# EAGLE design Grove Cape for BeagleBone Series v1.0 (EAGLE 7.1.0)
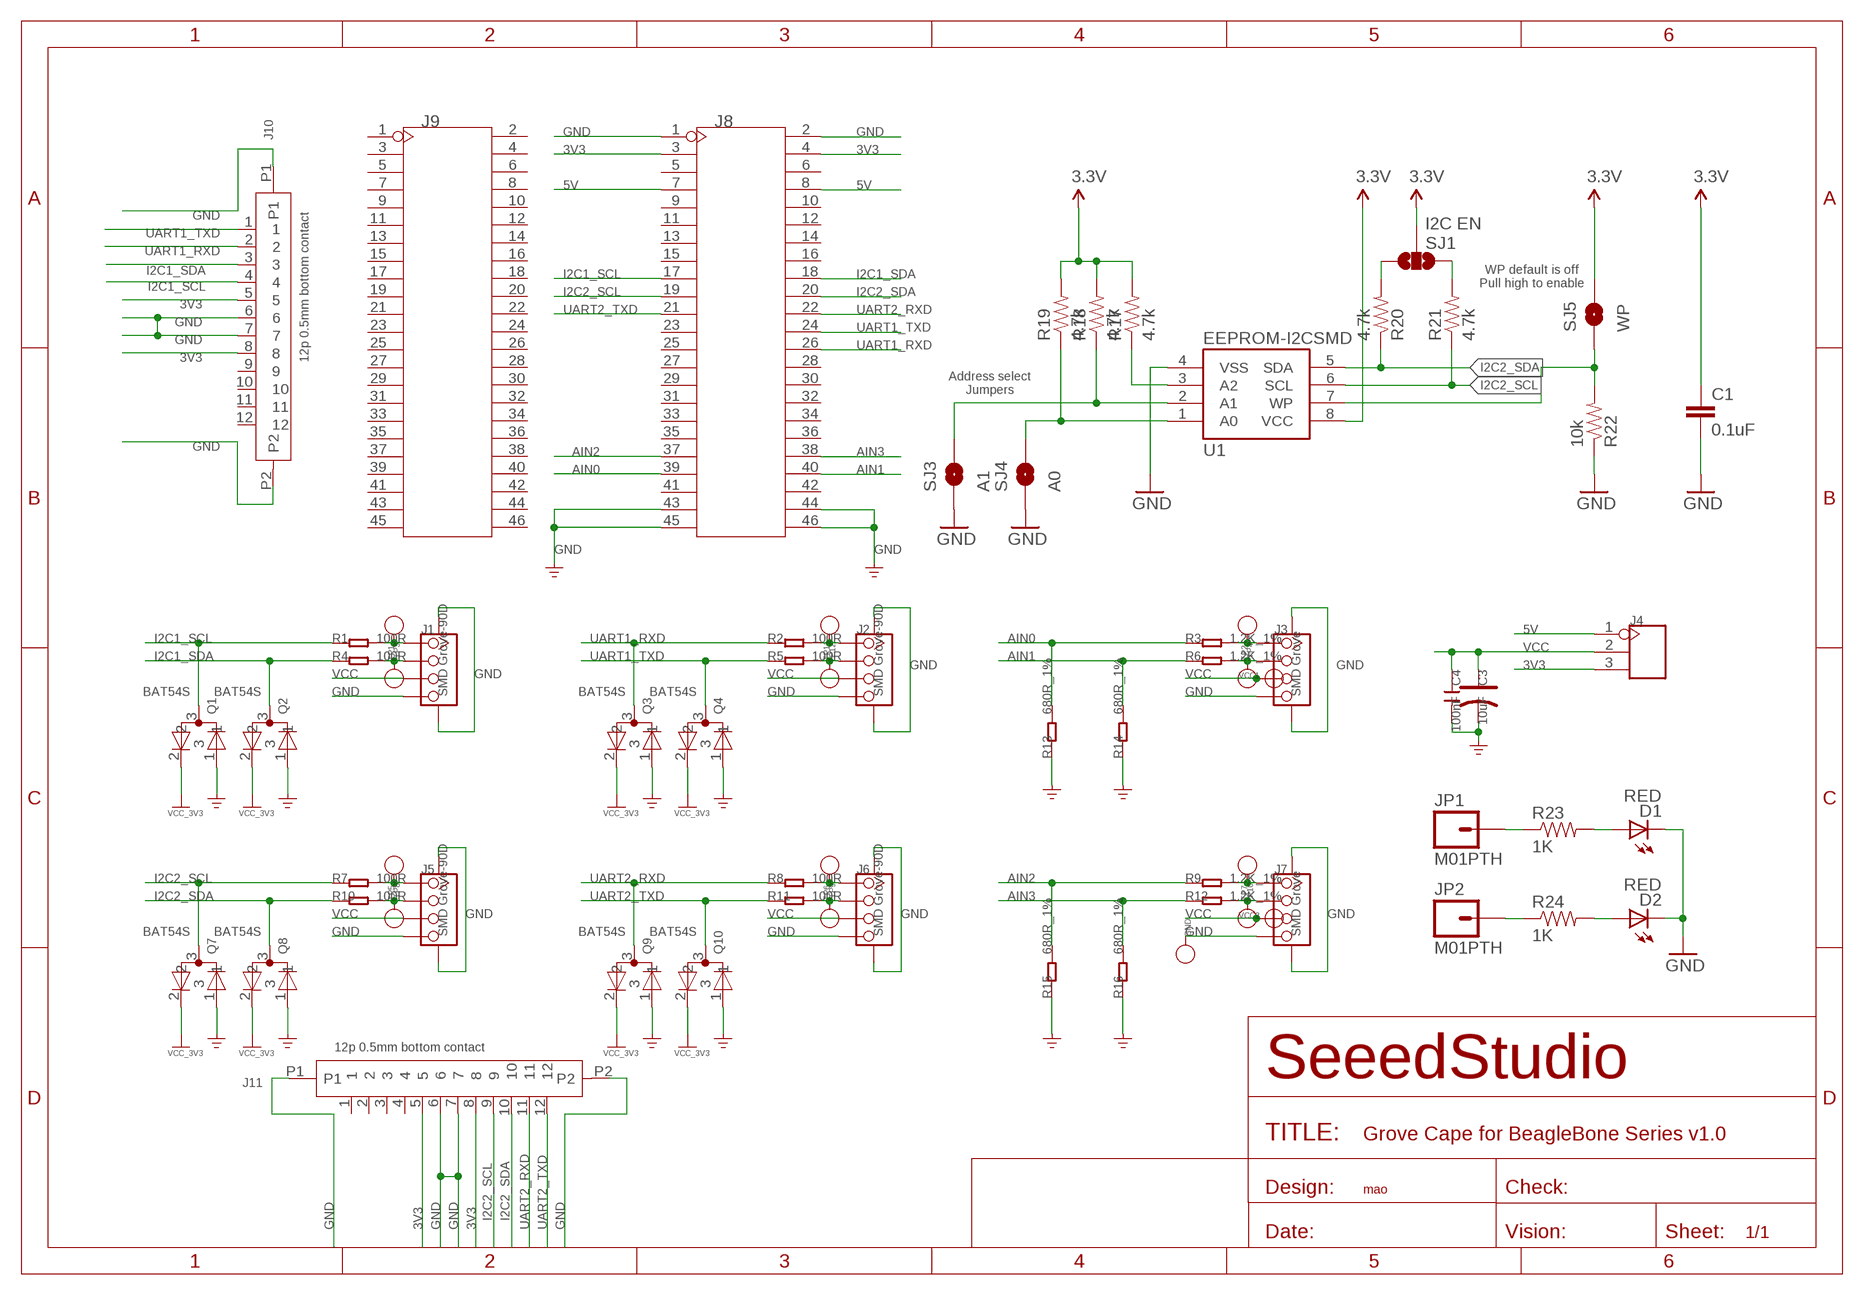
[diagram p0: schematic, sheet 1]

## Parts
C1  0.1uF  0.1UF-25V(+80/-20%)(0603)  [0603-CAP]
C3  10uF  CAP-AVX-A  [AVX-A]
C4  100nF  C-0603  [C0603]
D1  RED  LED-RED0603  [LED-0603]
D2  RED  LED-RED0603  [LED-0603]
GND  PAD-TEST-POINT'4545'  [TP_4545]
J1  SMD Grove-90D  TWIG-4P-2.0-SMD-FEMALE-REINFORCE'DD'  [4P-SMD-2.0]
J2  SMD Grove-90D  TWIG-4P-2.0-SMD-FEMALE-REINFORCE'DD'  [4P-SMD-2.0]
J3  SMD Grove  TWIG-4P-2.0-SMD-FEMALE-REINFORCE'DD'  [4P-SMD-2.0]
J4  HEADER-3P-2.54  [3P-2.54]
J5  SMD Grove-90D  TWIG-4P-2.0-SMD-FEMALE-REINFORCE'DD'  [4P-SMD-2.0]
J6  SMD Grove-90D  TWIG-4P-2.0-SMD-FEMALE-REINFORCE'DD'  [4P-SMD-2.0]
J7  SMD Grove  TWIG-4P-2.0-SMD-FEMALE-REINFORCE'DD'  [4P-SMD-2.0]
J8  HEADER-2X23P  [2X23P-2.54]
J9  HEADER-2X23P  [2X23P-2.54]
J10  12p 0.5mm bottom contact  FPC052002-12LT  [12P-0.5]
J11  12p 0.5mm bottom contact  FPC052002-12LT  [12P-0.5]
JP1  M01PTH  [1X01]
JP2  M01PTH  [1X01]
Q1  BAT54S  BAV99  [SOT23]
Q2  BAT54S  BAV99  [SOT23]
Q3  BAT54S  BAV99  [SOT23]
Q4  BAT54S  BAV99  [SOT23]
Q7  BAT54S  BAV99  [SOT23]
Q8  BAT54S  BAV99  [SOT23]
Q9  BAT54S  BAV99  [SOT23]
Q10  BAT54S  BAV99  [SOT23]
R1  100R  R-0603  [R0603]
R2  100R  R-0603  [R0603]
R3  1.2K_1%  R-0603  [R0603]
R4  100R  R-0603  [R0603]
R5  100R  R-0603  [R0603]
R6  1.2K_1%  R-0603  [R0603]
R7  100R  R-0603  [R0603]
R8  100R  R-0603  [R0603]
R9  1.2K_1%  R-0603  [R0603]
R10  100R  R-0603  [R0603]
R11  100R  R-0603  [R0603]
R12  1.2K_1%  R-0603  [R0603]
R13  680R_1%  R-0603  [R0603]
R14  680R_1%  R-0603  [R0603]
R15  680R_1%  R-0603  [R0603]
R16  680R_1%  R-0603  [R0603]
R17  4.7k  4.7KOHM1/10W1%(0603)  [0603]
R18  4.7k  4.7KOHM1/10W1%(0603)  [0603]
R19  4.7k  4.7KOHM1/10W1%(0603)  [0603]
R20  4.7k  4.7KOHM1/10W1%(0603)  [0603]
R21  4.7k  4.7KOHM1/10W1%(0603)  [0603]
R22  10k  10KOHM1/10W1%(0603)0603  [0603-RES]
R23  1K  1KOHM1/10W1%(0603)  [0603-RES]
R24  1K  1KOHM1/10W1%(0603)  [0603-RES]
SJ1  I2C EN  SOLDERJUMPER_2WAYPASTE1&2&3  [SJ_3_PASTE1&2&3]
SJ3  A1  SOLDERJUMPERNO  [SJ_2S-NO]
SJ4  A0  SOLDERJUMPERNO  [SJ_2S-NO]
SJ5  WP  SOLDERJUMPERNO  [SJ_2S-NO]
TP1  PAD-TEST-POINT'4545'  [TP_4545]
TP2  PAD-TEST-POINT'4545'  [TP_4545]
TP3  PAD-TEST-POINT'4545'  [TP_4545]
TP4  PAD-TEST-POINT'4545'  [TP_4545]
TP5  PAD-TEST-POINT'4545'  [TP_4545]
TP6  PAD-TEST-POINT'4545'  [TP_4545]
TP7  PAD-TEST-POINT'4545'  [TP_4545]
TP8  PAD-TEST-POINT'4545'  [TP_4545]
TP9  PAD-TEST-POINT'4545'  [TP_4545]
TP10  PAD-TEST-POINT'4545'  [TP_4545]
TP11  PAD-TEST-POINT'4545'  [TP_4545]
TP12  PAD-TEST-POINT'4545'  [TP_4545]
U1  EEPROM-I2CSMD  [SO08]
VCC1  PAD-TEST-POINT'4545'  [TP_4545]
VCC2  PAD-TEST-POINT'4545'  [TP_4545]

## Nets
3V3: C1.1 J4.3 J8.3 J8.4 J10.5 J10.8 J11.5 J11.8 Q1.2 Q2.2 Q3.2 Q4.2 Q7.2 Q8.2 Q9.2 Q10.2 R17.2 R18.2 R19.2 SJ1.2 SJ5.2 U1.8(VCC) ; supply symbol labelled 3.3V, VCC_3V3
5V: J4.1 J8.7 J8.8
A0: R19.1 SJ4.2 U1.1(A0)
A1: R18.1 SJ3.2 U1.2(A1)
AIN0: J8.39 R3.1 R13.2
AIN1: J8.40 R6.1 R14.2
AIN2: J8.37 R9.1 R15.2
AIN3: J8.38 R12.1 R16.2
GND: C1.2 C3.- C4.2 D1.C D2.C GND.T J1.4 J1.SS1 J1.SS2 J2.4 J2.SS1 J2.SS2 J3.4 J3.SS1 J3.SS2 J5.4 J5.SS1 J5.SS2 J6.4 J6.SS1 J6.SS2 J7.4 J7.SS1 J7.SS2 J8.1 J8.2 J8.43 J8.44 J8.45 J8.46 J10.6 J10.7 J10.P1 J10.P2 J11.6 J11.7 J11.P1 J11.P2 Q1.1 Q2.1 Q3.1 Q4.1 Q7.1 Q8.1 Q9.1 Q10.1 R13.1 R14.1 R15.1 R16.1 R22.1 SJ3.1 SJ4.1 U1.4(VSS)
I2C1_SCL: J8.17 J10.4 Q1.3 R1.1
I2C1_SDA: J8.18 J10.3 Q2.3 R4.1
I2C2_SCL: J8.19 J11.9 Q7.3 R7.1 R21.1 U1.6(SCL)
I2C2_SDA: J8.20 J11.10 Q8.3 R10.1 R20.1 U1.5(SDA)
N$1: R17.1 U1.3(A2)
N$2: J7.1 R9.2 TP7.T
N$3: J7.2 R12.2 TP10.T
N$4: J1.1 R1.2 TP1.T
N$5: J1.2 R4.2 TP3.T
N$6: J2.1 R2.2 TP11.T
N$7: J2.2 R5.2 TP12.T
N$8: J5.1 R7.2 TP5.T
N$9: J5.2 R10.2 TP8.T
N$10: J6.1 R8.2 TP6.T
N$11: J6.2 R11.2 TP9.T
N$12: J3.1 R3.2 TP2.T
N$13: J3.2 R6.2 TP4.T
N$16: R20.2 SJ1.3
N$17: R21.2 SJ1.1
N$18: R22.2 SJ5.1 U1.7(WP)
N$19: D1.A R23.2
N$20: D2.A R24.2
N$21: JP1.1 R23.1
N$30: JP2.1 R24.1
UART1_RXD: J8.26 J10.2 Q3.3 R2.1
UART1_TXD: J8.24 J10.1 Q4.3 R5.1
UART2_RXD: J8.22 J11.11 Q9.3 R8.1
UART2_TXD: J8.21 J11.12 Q10.3 R11.1
VCC: C3.+ C4.1 J1.3 J2.3 J3.3 J4.2 J5.3 J6.3 J7.3 VCC1.T VCC2.T
Unconnected: J8.5 J8.6 J8.9 J8.10 J8.11 J8.12 J8.13 J8.14 J8.15 J8.16 J8.23 J8.25 J8.27 J8.28 J8.29 J8.30 J8.31 J8.32 J8.33 J8.34 J8.35 J8.36 J8.41 J8.42 J9.1 J9.2 J9.3 J9.4 J9.5 J9.6 J9.7 J9.8 J9.9 J9.10 J9.11 J9.12 J9.13 J9.14 J9.15 J9.16 J9.17 J9.18 J9.19 J9.20 J9.21 J9.22 J9.23 J9.24 J9.25 J9.26 J9.27 J9.28 J9.29 J9.30 J9.31 J9.32 J9.33 J9.34 J9.35 J9.36 J9.37 J9.38 J9.39 J9.40 J9.41 J9.42 J9.43 J9.44 J9.45 J9.46 J10.9 J10.10 J10.11 J10.12 J11.1 J11.2 J11.3 J11.4

## Notes on the sheet
- WP default is off
  Pull high to enable
- Address select
  Jumpers
- mao

## Library data of the parts
C1 = SparkFun-Capacitors:0.1UF-25V(+80/-20%)(0603): CAP-00810 Ceramic Standard decoupling cap; PROD_ID: CAP-00810
C3 = Discrete:CAP*: Electrolytic Capacitors,Tantalum Capacitors and Super Capacitors
C4 = Discrete:C*: Ceramic Capacitors
D1 D2 = SparkFun-LED:LED-RED: Assorted Red LEDs LilyPad 1206- DIO-09912 1206- DIO-00809 0603- DIO-00819; PROD_ID: DIO-00819
GND TP1-TP12 VCC1 VCC2 = Discrete:PAD-TEST-POINT; PARTNO: DNP
J1-J3 J5-J7 = Connector :TWIG-4P-2.0-SMD-FEMALE-REINFORCE
J4 = Connector :HEADER-3P
J8 J9 = Connector :HEADER-2X23P
J10 J11 = template:FPC052002-12LT
JP1 JP2 = SparkFun-Connectors:M01: Header 1 Standard 1-pin 0.1" header. Use with straight break away headers (SKU : PRT-00116), right angle break away headers (PRT-00553), swiss pins (PRT-00743), machine pins (PRT-00117), and female headers (PRT-00115).
Q1-Q4 Q7-Q10 = template:BAV99
R1-R16 = Discrete:R*
R17-R21 = SparkFun-Resistors:4.7KOHM1/10W1%(0603): RES-07857; PROD_ID: RES-07857
R22 = SparkFun-Resistors:10KOHM1/10W1%(0603): RES-00824; PROD_ID: RES-00824; VALUE: 10K
R23 R24 = SparkFun-Resistors:1KOHM1/10W1%(0603): RES-07856; PROD_ID: RES-07856
SJ1 = SparkFun-Passives:SOLDERJUMPER_2WAY: Solder Jumper 2 way solder jumper
SJ3-SJ5 = SparkFun-Passives:SOLDERJUMPER: Solder Jumper Standard SMD solder jumper. Used to automate production. Two varients : Normally Open and Normally Closed are the same, but have different paste layers. NC will have a large amount of paste and should jumper during reflow.
U1 = SparkFun-DigitalIC:EEPROM-I2C: I2C EEPROM chips, 24LC256 (and others)

## Net classes
0 default: width 0.152 mm, drill 0.305 mm, clearance 0.152 mm

## Board
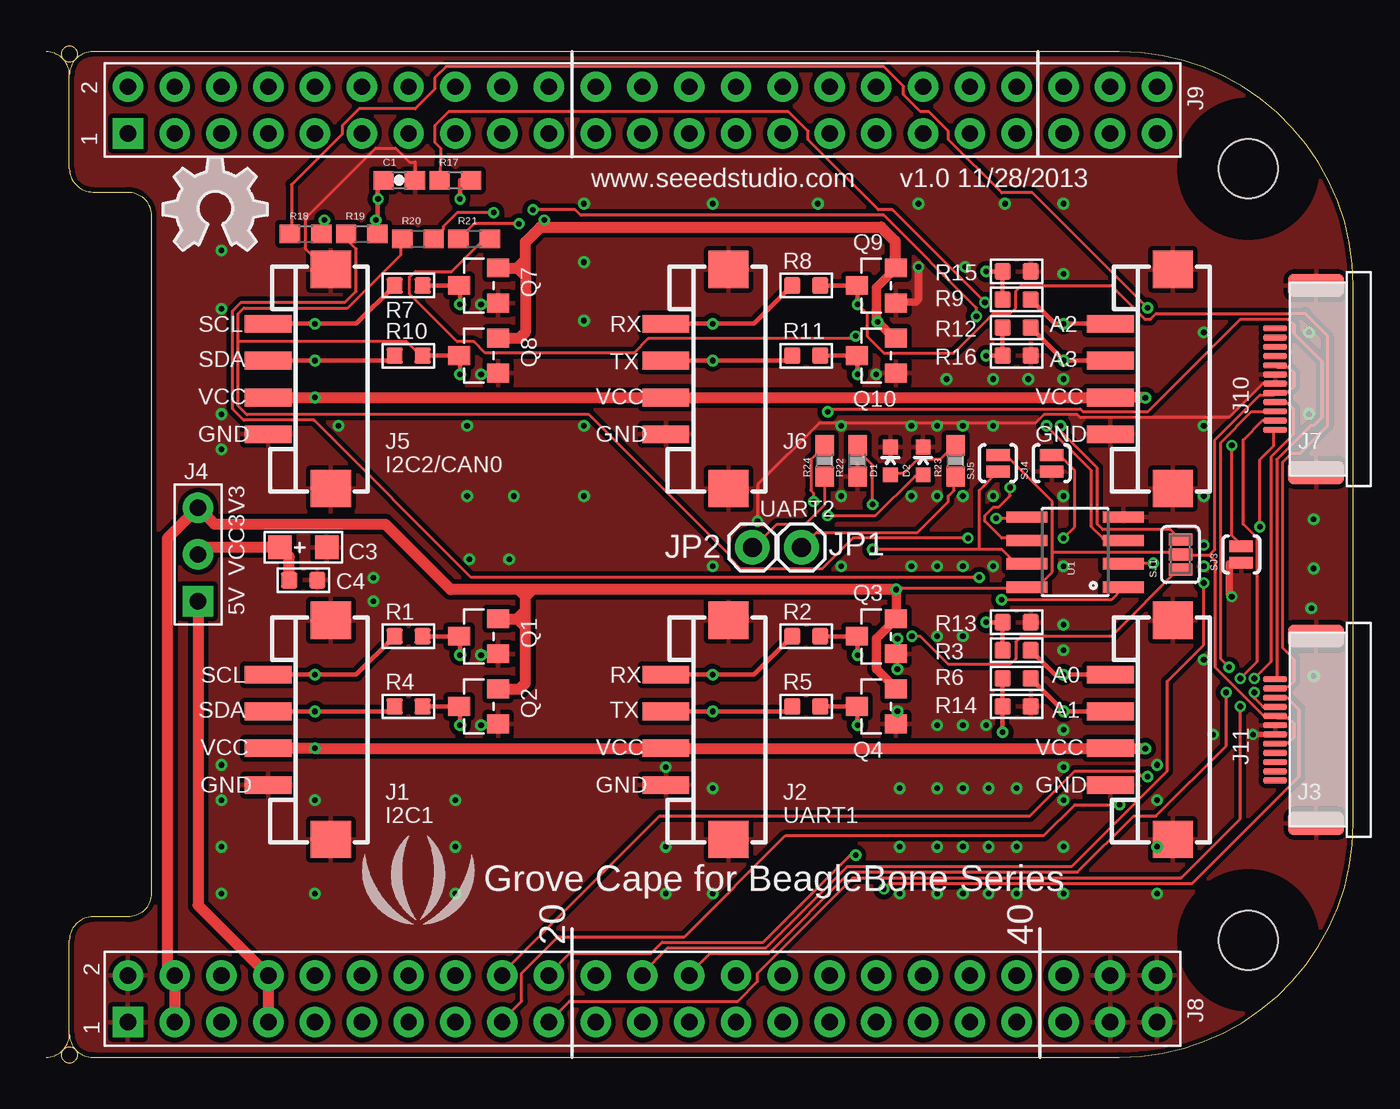
[diagram p1: board, top side]
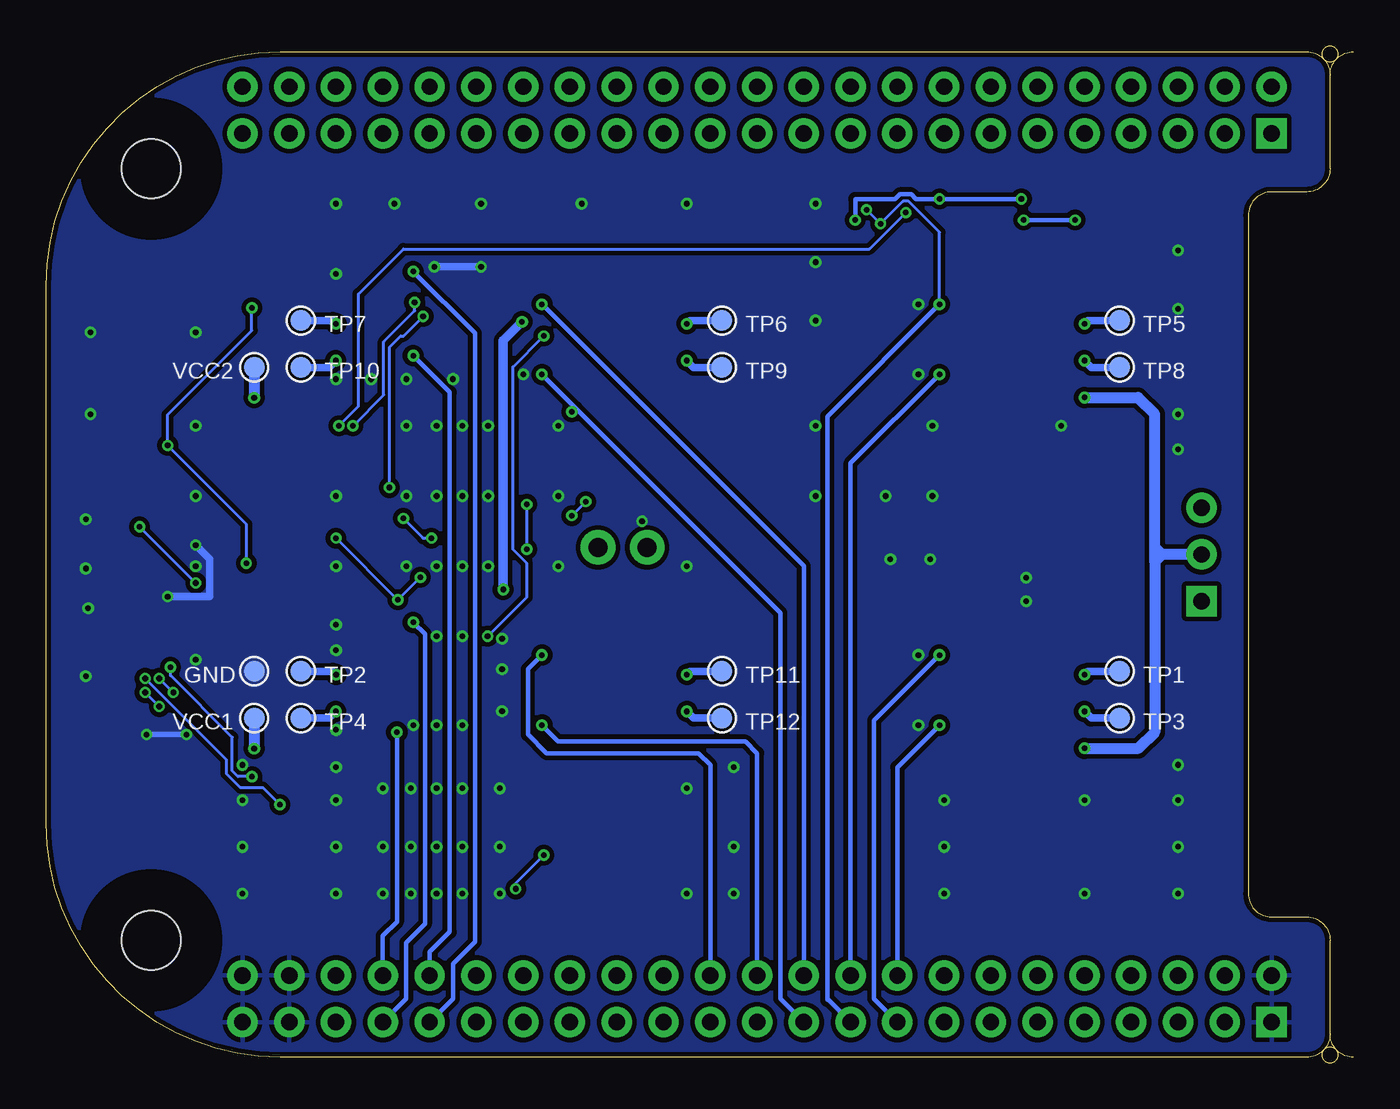
[diagram p2: board, bottom side, seen from below]

Size 70.99 x 55.22 mm. Coordinates in mm from the lower left corner, seen from the top.
Outline: 1.27,1.57 arc90 2.54,0.3 58.29,0.3 arc90 70.99,13 70.99,42.21 arc90 58.29,54.91 2.54,54.91 arc90 1.27,53.64
Outline: 1.27,53.64 1.27,48.56 arc90 2.54,47.29 4.45,47.29 arc-90 5.71,46.02 5.71,9.19 arc-90 4.45,7.92 2.54,7.92 arc90 1.27,6.65 1.27,1.57
Outline: 1.27,53.64 arc90 0,54.91
Outline: 0,0.3 arc90 1.27,1.57
Outline: circle at 1.27,0.43 radius 0.43
Outline: circle at 1.27,54.79 radius 0.43
Copper layers (1*16): Top 0.035mm / dielectric 1.5mm / Bottom 0.035mm
Design rules "SeeedStudio_2layer_DRU_no_angle_20140221": minimum track width 6mil, minimum drill 12mil, track to track 6mil, track to pad 6mil, pad to pad 6mil, via to via 6mil, smd to smd 0mil, copper to edge 10mil, drill to drill 10mil, minimum pad ring 10mil, minimum via ring 6mil, stop-mask expansion 2mil, vias tented up to drill 100mil, thermal gap 10mil

### Footprints (pad centres in the part's own frame; a part is rotated, then mirrored left to right if it is on the bottom)
0603-CAP = smd 1.1 x 1: 1 -0.85,0; 2 0.85,0
AVX-A = smd 1.27 x 1.27: + -1.27,0; - 1.27,0
C0603 = smd 0.889 x 0.889: 1 -0.762,0; 2 0.762,0
LED-0603 = smd 0.8 x 0.8: A 0,-0.75; C 0,0.75
TP_4545 = smd 1.143 x 1.143: T 0,0
4P-SMD-2.0 = smd 0.965 x 2.54: 1 -3,0; 2 -1,0; 3 1,0; 4 3,0 | smd 2.032 x 2.184: SS1 -5.946,3.4; SS2 5.946,3.4
3P-2.54 = drill 0.889 pad 1.651 square: 1 0,2.54 | drill 0.889 pad 1.651: 2 0,0; 3 0,-2.54
2X23P-2.54 = drill 0.889 pad 1.651 square: 1 -1.27,27.94 | drill 0.889 pad 1.651: 2 1.27,27.94; 3 -1.27,25.4; 4 1.27,25.4; 5 -1.27,22.86; 6 1.27,22.86; 7 -1.27,20.32; 8 1.27,20.32; 9 -1.27,17.78; 10 1.27,17.78; 11 -1.27,15.24; 12 1.27,15.24; 13 -1.27,12.7; 14 1.27,12.7; 15 -1.27,10.16; 16 1.27,10.16; 17 -1.27,7.62; 18 1.27,7.62; 19 -1.27,5.08; 20 1.27,5.08; 21 -1.27,2.54; 22 1.27,2.54; 23 -1.27,0; 24 1.27,0; 25 -1.27,-2.54; 26 1.27,-2.54; 27 -1.27,-5.08; 28 1.27,-5.08; 29 -1.27,-7.62; 30 1.27,-7.62; 31 -1.27,-10.16; 32 1.27,-10.16; 33 -1.27,-12.7; 34 1.27,-12.7; 35 -1.27,-15.24; 36 1.27,-15.24; 37 -1.27,-17.78; 38 1.27,-17.78; 39 -1.27,-20.32; 40 1.27,-20.32; 41 -1.27,-22.86; 42 1.27,-22.86; 43 -1.27,-25.4; 44 1.27,-25.4; 45 -1.27,-27.94; 46 1.27,-27.94
12P-0.5 = smd 0.3 x 1.3: 1 -2.75,2.35; 2 -2.25,2.35; 3 -1.75,2.35; 4 -1.25,2.35; 5 -0.75,2.35; 6 -0.25,2.35; 7 0.25,2.35; 8 0.75,2.35; 9 1.25,2.35; 10 1.75,2.35; 11 2.25,2.35; 12 2.75,2.35 | smd 1.27 x 3.048: P1 -5.08,0.127; P2 5.08,0.127
1X01 = drill 1.016 pad 1.88: 1 0,0
SOT23 = smd 1.016 x 1.2: 1 -0.95,-1.06; 2 0.95,-1.06; 3 0,1.06
R0603 = smd 0.889 x 0.889: 1 -0.762,0; 2 0.762,0
0603 = smd 1.1 x 1: 1 -0.85,0; 2 0.85,0
0603-RES = smd 1.1 x 1: 1 -0.85,0; 2 0.85,0
SJ_3_PASTE1&2&3 = smd 0.635 x 1.27: 1 -0.813,0; 2 0,0; 3 0.813,0
SJ_2S-NO = smd 0.635 x 1.27: 1 -0.45,0; 2 0.45,0
SO08 = smd 0.61 x 2.21: 1 -1.905,-2.616; 2 -0.635,-2.616; 3 0.635,-2.616; 4 1.905,-2.616; 5 1.905,2.616; 6 0.635,2.616; 7 -0.635,2.616; 8 -1.905,2.616
HOLE-3.2/7.0 = hole 3.2: 0,0

### Placement (x,y rotation side)
C1  19.18,47.93 0 top
C3  13.97,27.99 0 top
C4  13.97,26.21 0 top
D1  45.85,32.69 0 top
D2  47.62,32.69 0 top
GND  59.69,21.26 0 bottom
J1  12.07,18.08 270 top
J2  33.66,18.08 270 top
J3  57.79,18.08 270 top
J4  8.26,27.61 180 top
J5  12.07,37.13 270 top
J6  33.66,37.13 270 top
J7  57.79,37.13 270 top
J8  32.38,3.48 90 top
J9  32.38,51.74 90 top
J10  69.09,37.13 90 top
J11  69.09,18.08 90 top
JP1  41.02,27.99 0 top
JP2  38.35,27.99 0 top
Q1  23.5,23.16 90 top
Q2  23.5,19.35 90 top
Q3  45.09,23.16 90 top
Q4  45.09,19.35 90 top
Q7  23.5,42.21 90 top
Q8  23.5,38.4 90 top
Q9  45.09,42.21 90 top
Q10  45.09,38.4 90 top
R1  19.69,23.16 180 top
R2  41.27,23.16 180 top
R3  52.7,22.4 0 top
R4  19.69,19.35 180 top
R5  41.27,19.35 180 top
R6  52.7,20.88 0 top
R7  19.69,42.21 180 top
R8  41.27,42.21 180 top
R9  52.7,41.45 0 top
R10  19.69,38.4 180 top
R11  41.27,38.4 180 top
R12  52.7,39.93 0 top
R13  52.7,23.93 180 top
R14  52.7,19.35 180 top
R15  52.7,42.98 180 top
R16  52.7,38.4 180 top
R17  22.23,47.93 0 top
R18  14.1,45.01 0 top
R19  17.14,45.01 0 top
R20  20.19,44.75 0 top
R21  23.24,44.75 0 top
R22  44.07,32.69 90 top
R23  49.4,32.69 90 top
R24  42.29,32.69 90 top
SJ1  61.59,27.61 90 top
SJ3  64.9,27.61 90 top
SJ4  54.61,32.56 90 top
SJ5  51.69,32.56 90 top
TP1  12.7,21.26 0 bottom
TP2  57.15,21.26 0 bottom
TP3  12.7,18.72 0 bottom
TP4  57.15,18.72 0 bottom
TP5  12.7,40.31 0 bottom
TP6  34.29,40.31 0 bottom
TP7  57.15,40.31 0 bottom
TP8  12.7,37.77 0 bottom
TP9  34.29,37.77 0 bottom
TP10  57.15,37.77 0 bottom
TP11  34.29,21.26 0 bottom
TP12  34.29,18.72 0 bottom
U1  55.88,27.74 90 top
U$26  [HOLE-3.2/7.0]  65.28,48.56 0 top
U$27  [HOLE-3.2/7.0]  65.28,6.65 0 top
U$29  [LOGO_SILK]  20.19,9.19 0 top
U$33  [OSHW_FILLX200_NOTEXT]  6.35,44.12 0 top
VCC1  59.69,18.72 0 bottom
VCC2  59.69,37.77 0 bottom

### Tracks (layer width: path | path; a pad name or v marks a point on that pad's centre or on a via)
3V3  (via drill 0.3, 0.3 pad 0.64)
  Top 0.152: 26.59,45.41 26.85,45.39 | J10.8 66.83,37.79 67.44,37.79 67.74,37.49 67.74,36.73 67.44,36.42 66.83,36.42 J10.5 66.67,36.27 65.91,36.27 63.48,33.83 63.48,27.89 63.17,27.58 | J11.5 66.83,17.37 67.44,17.37 67.74,17.68 67.74,18.44 67.44,18.74 66.83,18.74 J11.8 66.67,18.9 66.06,18.9 63.48,21.49 63.48,27.28 63.17,27.58 | 54.63,27.74 54.63,26.67 53.87,25.91 53.26,25.91 U1.8 53.26,25.76 46.41,25.76 v46.16,25.7 | 54.63,27.74 54.63,30.48 52.2,32.92 51.74,32.92 SJ5.2 | 54.63,27.74 61.49,27.74 SJ1.2 61.65,27.58 63.17,27.58
  Top 0.254: C1.1 18,47.93 18,46.91 | 18,46.91 18,45.77 | 18,45.77 R19.2 | v15.11,45.77 15.11,44.75 R18.2 | v17.91,45.77 18,45.77 | v22.48,46.91 22.48,47.93 R17.2 | v18.03,46.91 18,46.91 | v27.05,45.77 27.05,45.39
  Top 0.508: Q9.2 45.09,42.1 45.09,40.31 v45.15,40.25 46.04,39.35 Q10.2 | Q4.2 46.15,20.33 45.09,21.39 45.09,23.05 Q3.2 46.16,24.13 v46.16,25.7
  Top 0.61: Q7.2 25.59,43.16 | 25.59,43.16 26.04,42.72 | 26.04,42.72 26.04,39.67 25.71,39.35 Q8.2 | Q2.2 25.71,20.3 26.04,20.62 26.04,23.67 | 26.04,23.67 26.04,24.18 | 26.04,24.18 26.04,24.56 | 26.04,24.56 26.04,25.32 | 26.04,25.32 26.04,25.7 | Q1.2 25.59,24.11 | 25.59,24.11 25.97,24.11 26.04,24.18 | 26.04,42.72 26.04,43.61 | 26.04,43.61 26.04,44.58 26.85,45.39 27.05,45.39 45.34,45.39 46.1,44.63 46.1,43.21 Q9.2 | v46.16,25.7 26.42,25.7 | 26.42,25.7 26.04,25.7 | 26.04,25.7 25.65,25.7 | 25.65,25.7 21.97,25.7 18.41,29.26 9.14,29.26 J4.3 6.6,28.5 6.6,5.13 J8.4 J8.3 | 25.59,24.11 26.04,24.56 | 25.59,24.11 | 25.59,24.11 26.04,23.67 | 26.04,25.32 25.65,25.7 | 26.04,25.32 26.42,25.7 | 25.59,43.16 26.04,43.61
  Bottom 0.254: v15.11,45.77 v17.91,45.77 | v18.03,46.91 v22.48,46.91 23.75,46.91 24,47.17 24.64,47.17 24.89,46.91 27.05,46.91 v27.05,45.77
  Bottom 0.508: v46.16,25.7 46.16,39.23 v45.15,40.25
5V
  Top 0.61: J4.1 8.26,8.56 J8.8 J8.7
A0  (via drill 0.3)
  Top 0.152: v50.67,26.36 23.09,26.36 14.55,34.9 10.74,34.9 10.14,35.51 10.14,40.84 10.59,41.3 16.23,41.3 16.84,41.91 16.84,44.2 16.38,44.65 R19.1 | v51.89,25.15 57.84,25.15 58.45,25.76 U1.1 | v55.24,28.5 55.86,29.11 55.86,32.16 55.09,32.92 54.63,32.92 SJ4.2
  Bottom 0.152: v50.67,26.36 v51.89,25.15 v55.24,28.5
A1  (via drill 0.3)
  Top 0.152: v59.82,41 53.57,47.24 51.89,47.24 49,50.14 49,50.6 47.93,51.66 47.47,51.66 46.56,52.58 46.56,53.03 45.49,54.1 21.72,54.1 21.11,53.49 21.11,52.88 20.04,51.82 16.99,51.82 16.08,50.9 16.08,50.44 13.34,47.7 13.34,44.81 R18.1 | v64.39,33.53 64.39,28.65 64.85,28.19 SJ3.2 | v60.12,27.13 58.6,27.13 U1.2
  Bottom 0.152: v59.82,41 59.82,39.78 64.39,35.2 v64.39,33.53 60.12,29.26 v60.12,27.13
AIN0  (via drill 0.3 pad 0.64)
  Top 0.254: R3.1 R13.2 v51.05,23.93
  Bottom 0.254: J8.39 51.44,3.48 51.44,6.53 50.42,7.54 50.42,23.29 v51.05,23.93
AIN1  (via drill 0.3 pad 0.64)
  Top 0.254: R6.1 R14.2 v51.94,17.96
  Bottom 0.254: J8.40 52.7,6.91 51.94,7.67 v51.94,17.96 52.07,18.08
AIN2  (via drill 0.3 pad 0.64)
  Top 0.254: v51.05,42.98 R15.2 R9.1
  Bottom 0.254: J8.37 48.9,3.48 48.9,5.38 47.7,6.58 47.7,39.63 v51.05,42.98
AIN3  (via drill 0.3 pad 0.64)
  Top 0.254: v51.05,38.4 R16.2 R12.1
  Bottom 0.254: J8.38 50.16,6.02 49.08,7.11 49.08,36.43 v51.05,38.4
GND  (via drill 0.3, 0.3 pad 0.64)
  Top 0.152: 66.74,36.92 66.83,36.88 J10.6 66.67,36.88 66.06,36.88 64.24,35.05 56.16,35.05 56.01,35.2 54.18,35.2 53.72,34.75 41.99,34.75 38.63,31.39 v38.63,29.41 | C1.2 20.04,48.92 19.74,48.92 18.97,49.68 17.91,49.68 14.1,45.87 14.1,44.2 15.32,42.98 J5.SS1
  Top 0.305: v63.37,17.83 63.37,17.7 | v65.53,17.83 66.67,17.83 J11.6
  Top 0.406: v49.91,43.23 49.91,43.36 | v47.37,43.23 47.37,41.45 47.24,41.33 46.23,41.33 Q9.1 | v62.87,28.12 62.87,28.24 | v64.39,25.32 64.26,25.45 64.26,27.1 64.9,27.1 SJ3.1
  Bottom 0.305: v65.53,17.83 v63.37,17.83
  Bottom 0.406: v47.37,43.23 v49.91,43.23 | v62.87,28.12 62.1,27.36 62.1,25.32 v64.39,25.32
  other vias: 36.2,9.19 29.21,34.59 29.21,30.78 9.53,35.23 9.53,33.32 23.62,41.2 23.62,37.39 55.24,16.05 55.24,14.27 33.66,16.05 22.99,27.36 22.86,30.78 25.15,27.36 23.62,22.15 25.4,30.78 9.53,16.18 9.53,14.27 17.78,26.34 17.78,25.07 14.61,9.19 55.24,26.97 62.87,26.97 62.87,39.67 68.58,39.67 68.58,35.23 62.87,21.89 68.83,26.85 68.71,24.69 68.83,21.01 43.18,34.59 23.62,18.34 22.23,9.19 46.36,11.73 22.86,34.59 33.66,11.73 33.66,9.19 46.36,14.91 9.53,9.19 22.23,14.27 22.23,11.73 29.21,43.48 41.91,46.66 47.37,46.66 55.24,46.66 55.24,42.85 46.36,9.19 55.24,9.19 55.24,11.73 52.7,9.19 15.88,34.59 43.18,30.78 36.2,14.91 36.2,26.97 43.18,26.97 9.53,44.12 52.7,11.73 52.7,14.91 14.61,14.27 9.53,11.73 62.87,30.78 68.83,29.51 29.21,40.31 29.21,46.66 9.53,40.94 36.2,46.66 52.07,46.66 51.44,34.59 51.44,30.78 51.44,26.97 60.33,16.18 60.33,14.27 60.33,11.73 60.33,9.19 55.24,30.78 62.87,34.59 46.23,23.04 46.23,21.39 46.23,19.1 45.09,37.39 48.9,37.13 55.24,23.8 55.24,22.4 55.24,18.08 55.24,37.13 53.34,37.13 51.44,37.13 46.99,34.59 46.99,30.78 46.99,26.97 48.39,34.59 48.39,30.78 48.39,26.97 48.39,23.16 48.39,18.34 48.39,14.91 48.39,11.73 48.39,9.19 49.78,23.16 49.78,18.34 49.78,14.91 49.78,11.73 49.78,9.19 51.05,18.34 51.18,14.91 51.18,11.73 51.18,9.19 49.78,34.59 49.78,30.78 49.78,26.97
  pour Top (isolate 0.254): 1.27,54.91 71.12,54.91 71.12,0.3 1.27,0.3
  pour Bottom (isolate 0.254): 1.27,54.91 71.12,54.91 71.12,0.3 1.27,0.3
I2C1_SCL  (via drill 0.3, 0.3 pad 0.64)
  Top 0.152: v65.61,20.88 66.52,21.79 66.52,32.92 67.74,34.14 67.74,35.51 67.44,35.81 66.83,35.81 J10.4 | v58.29,14.02 55.86,14.02 54.18,12.34 40.16,12.34 34.67,6.86 27.81,6.86 25.83,4.88 25.83,3.35 24.77,2.29 J8.17
  Top 0.254: R1.1 Q1.3 22.48,23.12 v22.48,22.15
  Bottom 0.152: v65.61,20.88 61.19,16.46 61.19,15.7 60.43,14.93 59.21,14.93 v58.29,14.02
  Bottom 0.254: J8.17 26.04,3.48 26.04,18.59 v22.48,22.15
I2C1_SDA  (via drill 0.3, 0.3 pad 0.64)
  Top 0.152: v64.24,21.49 63.78,21.95 63.78,33.68 65.46,35.36 66.67,35.36 J10.3 | v59.82,15.54 59.51,15.54 59.21,15.85 55.86,15.85 53.42,13.41 33.3,13.41 24.77,4.88 J8.18
  Top 0.254: R4.1 Q2.3 22.48,19.31 v22.48,18.34
  Bottom 0.152: v64.24,21.49 64.24,21.03 60.88,17.68 60.88,15.85 60.58,15.54 v59.82,15.54
  Bottom 0.254: J8.18 24.77,16.05 v22.48,18.34
I2C2_SCL  (via drill 0.3, 0.3 pad 0.64)
  Top 0.152: v65.61,20.12 65.61,19.81 66.06,19.35 66.67,19.35 J11.9 | v64.85,19.35 64.85,13.26 61.65,10.06 43.81,10.06 38.63,4.88 38.63,4.42 37.57,3.35 28.42,3.35 27.36,2.29 J8.19 | v25.68,45.57 23.24,45.57 22.48,44.81 R21.1 | v26.44,46.33 28.73,46.33 29.03,46.02 45.49,46.02 50.52,41 v50.52,40.54 | v52.35,31.24 52.35,30.78 51.74,30.17 51.44,30.17 50.98,29.72 50.98,29.41 51.89,28.5 53.26,28.5 U1.6
  Top 0.254: v22.48,41.2 22.48,42.17 Q7.3 R7.1
  Bottom 0.152: v64.85,19.35 v65.61,20.12 | v26.44,46.33 v25.68,45.57 24.46,46.79 24.16,46.79 22.48,45.11 v22.48,41.2 | v50.52,40.54 51.59,39.47 51.74,39.47 52.35,38.86 v52.35,31.24
  Bottom 0.254: J8.19 28.51,3.42 28.57,3.42 28.57,35.1 v22.48,41.2
I2C2_SDA  (via drill 0.3, 0.3 pad 0.64)
  Top 0.152: v45.49,9.45 45.8,9.75 62.26,9.75 68.05,15.54 68.05,19.2 67.44,19.81 66.83,19.81 J11.10 | v43.97,11.28 43.66,11.28 38.94,6.55 33.45,6.55 32.84,5.94 28.42,5.94 27.36,4.88 J8.20 | 10.44,39.17 10.44,35.66 10.9,35.2 29.49,35.2 37.11,27.58 37.11,27.43 37.72,26.82 42.14,26.82 43.81,28.5 v50.06,28.5 | 10.44,39.17 10.44,40.69 10.74,41 16.38,41 19.28,43.89 19.28,44.65 R20.1 | v51.59,29.57 53.26,29.57 U1.5 | 10.44,39.17 19.58,39.17 20.35,38.4 R10.1
  Top 0.203: 20.32,38.28 R10.1
  Top 0.254: R10.1 Q8.3 22.48,38.36 v22.48,37.39
  Bottom 0.152: v45.49,9.45 45.49,9.75 v43.97,11.28 | v50.06,28.5 50.52,28.5 v51.59,29.57
  Bottom 0.254: J8.20 27.3,32.56 v22.48,37.39
N$1  (via drill 0.3)
  Top 0.152: v50.98,41.3 45.95,46.33 45.19,46.33 41.38,50.14 41.38,50.6 40.31,51.66 21.87,51.66 21.11,50.9 21.11,49.99 21.41,49.68 21.41,48.92 R17.1 | v54.33,34.59 56.77,32.16 56.77,29.11 57.38,28.5 58.45,28.5 U1.3
  Bottom 0.152: v50.98,41.3 50.98,40.84 52.65,39.17 52.65,36.27 v54.33,34.59
N$2  (via drill 0.3 pad 0.64)
  Top 0.254: J7.1 v55.24,40.13 54.79,40.13 R9.2
  Bottom 0.406: TP7.T 55.42,40.31 v55.24,40.13
N$3  (via drill 0.3 pad 0.64)
  Top 0.254: J7.2 v55.26,38.13 R12.2
  Bottom 0.406: TP10.T 55.63,37.77 v55.26,38.13
N$4  (via drill 0.3 pad 0.64)
  Top 0.254: J1.1 v14.61,21.08 16.84,21.08 R1.2
  Bottom 0.406: TP1.T 14.43,21.26 v14.61,21.08
N$5  (via drill 0.3 pad 0.64)
  Top 0.254: J1.2 v14.61,19.08 18.65,19.08 R4.2
  Bottom 0.406: TP3.T 14.24,18.72 v14.61,19.08
N$6  (via drill 0.3 pad 0.64)
  Top 0.254: J2.1 v36.2,21.08 38.43,21.08 R2.2
  Bottom 0.406: TP11.T 36.02,21.26 v36.2,21.08
N$7  (via drill 0.3 pad 0.64)
  Top 0.254: J2.2 v36.2,19.08 40.24,19.08 R5.2
  Bottom 0.406: TP12.T 35.83,18.72 v36.2,19.08
N$8  (via drill 0.3 pad 0.64)
  Top 0.254: J5.1 v14.61,40.13 16.84,40.13 R7.2
  Bottom 0.406: TP5.T 14.43,40.31 v14.61,40.13
N$9  (via drill 0.3 pad 0.64)
  Top 0.254: J5.2 v14.61,38.13 18.65,38.13 R10.2
  Bottom 0.406: TP8.T 14.24,37.77 v14.61,38.13
N$10  (via drill 0.3 pad 0.64)
  Top 0.254: J6.1 v36.2,40.13 38.43,40.13 R8.2
  Bottom 0.406: TP6.T 36.02,40.31 v36.2,40.13
N$11  (via drill 0.3 pad 0.64)
  Top 0.254: J6.2 v36.2,38.13 40.24,38.13 R11.2
  Bottom 0.406: TP9.T 35.83,37.77 v36.2,38.13
N$12  (via drill 0.3 pad 0.64)
  Top 0.254: J3.1 v55.24,21.08 54.79,21.08 R3.2
  Bottom 0.254: 57.02,21.08 56.98,21.08 56.77,21.08
  Bottom 0.406: 56.98,21.08 TP2.T 55.42,21.26 v55.24,21.08
N$13  (via drill 0.3 pad 0.64)
  Top 0.254: J3.2 v55.26,19.08 R6.2
  Bottom 0.406: TP4.T 55.63,18.72 v55.26,19.08
N$16  (via drill 0.3)
  Top 0.152: v24.31,46.18 22.33,46.18 21.57,45.41 21.57,45.26 21.11,44.81 R20.2 | v55.09,34.59 55.09,34.29 57.07,32.31 57.07,29.26 57.38,28.96 61.04,28.96 61.49,28.5 SJ1.3
  Bottom 0.152: v24.31,46.18 26.29,44.2 51.59,44.2 54.03,41.76 54.03,35.66 v55.09,34.59
N$17  (via drill 0.3)
  Top 0.152: v43.97,39.47 43.81,39.32 32.69,39.32 31.93,38.56 23.85,38.56 23.24,39.17 22.33,39.17 19.74,41.76 19.74,42.67 20.04,42.98 22.02,42.98 23.7,44.65 24,44.65 R21.2 | v47.02,23.16 47.47,23.16 49,21.64 52.35,21.64 52.65,21.95 52.65,22.86 52.96,23.16 57.84,23.16 61.49,26.82 SJ1.1
  Bottom 0.152: v43.97,39.47 45.64,37.79 45.64,27.89 44.88,27.13 44.88,25.3 v47.02,23.16
N$18  (via drill 0.3)
  Top 0.152: v44.88,30.33 44.88,32.46 44.12,33.22 44.12,33.53 R22.2 | 50.67,27.89 51.89,27.89 52.65,27.13 53.26,27.13 U1.7 | 50.67,27.89 v44.88,27.89 | 50.67,27.89 50.67,31.09 51.59,32 SJ5.1
  Bottom 0.152: v44.88,27.89 v44.88,30.33
N$19
  Top 0.152: D1.A 45.95,32 46.56,32 47.32,32.77 48.54,32.77 49.3,33.53 R23.2
N$20  (via drill 0.3)
  Top 0.152: v42.44,29.72 45.03,29.72 47.17,31.85 47.62,31.85 D2.A | v41.68,30.48 41.68,30.94 41.53,31.09 41.53,32.77 R24.2
  Bottom 0.152: v41.68,30.48 v42.44,29.72
N$21
  Top 0.152: JP1.1 41.83,28.8 47.32,28.8 49,30.48 49,30.78 49.3,31.09 49.3,31.7 R23.1
N$30
  Top 0.152: R24.1 42.29,30.33 41.22,29.26 39.7,29.26 38.48,28.04 JP2.1
UART1_RXD  (via drill 0.3, 0.3 pad 0.64)
  Top 0.152: v64.85,20.88 65.76,21.79 65.76,28.5 65,29.26 65,33.83 66.06,34.9 66.67,34.9 J10.2 | v64.08,20.12 64.08,17.22 60.27,13.41 59.05,13.41 56.01,10.36 43.66,10.36 39.24,5.94 36.04,5.94 34.98,4.88 J8.26
  Top 0.254: R2.1 Q3.3 44.07,23.12 v44.07,22.15
  Bottom 0.152: v64.08,20.12 v64.85,20.88
  Bottom 0.254: J8.26 34.92,16.18 35.56,16.81 43.81,16.81 44.83,17.83 44.83,21.39 v44.07,22.15
UART1_TXD  (via drill 0.3, 0.3 pad 0.64)
  Top 0.152: v65.91,29.11 65.91,32.77 66.67,33.53 66.67,34.29 J10.1 | v62.87,26.06 62.87,22.71 60.88,20.73 60.88,15.85 55.7,10.67 43.51,10.67 39.09,6.25 33.76,6.25 32.38,4.88 J8.24
  Top 0.254: v44.07,18.34 44.07,19.31 Q4.3 R5.1
  Bottom 0.152: v62.87,26.06 v65.91,29.11
  Bottom 0.254: J8.24 32.38,16.81 33.02,17.45 43.18,17.45 v44.07,18.34
UART2_RXD  (via drill 0.3 pad 0.64)
  Top 0.152: v44.07,41.2 44.58,40.69 44.58,39.47 45.49,38.56 49.3,38.56 51.44,40.69 52.35,40.69 52.65,41 52.65,41.91 52.96,42.21 57.84,42.21 59.66,40.39 59.97,40.39 60.27,40.69 68.35,40.69 69.57,39.47 69.57,34.59 68.05,33.07 67.59,33.07 67.13,32.61 67.13,22.55 67.74,21.95 67.74,20.73 67.44,20.42 66.83,20.42 J11.11
  Top 0.254: R8.1 Q9.3 44.07,42.17 v44.07,41.2
  Bottom 0.254: J8.22 29.85,26.97 v44.07,41.2
UART2_TXD  (via drill 0.3, 0.3 pad 0.64)
  Top 0.152: v42.44,35.36 42.6,35.51 56.16,35.51 56.31,35.36 59.82,35.36 64.85,40.39 67.44,40.39 67.74,40.08 67.74,39.62 69.27,38.1 69.27,35.05 68.81,34.59 68.66,34.59 66.83,32.77 66.83,20.88 J11.12
  Top 0.254: R11.1 Q10.3 44.07,38.36 v44.07,37.39
  Bottom 0.152: 42.24,35.56 v42.44,35.36
  Bottom 0.254: J8.21 31.12,3.48 31.12,24.43 42.24,35.56 v44.07,37.39
VCC  (via drill 0.3 pad 0.64)
  Top 0.61: J5.3 v14.61,36.13 J6.3 J7.3 57.7,36.12 v59.69,36.12 | J1.3 v14.61,17.08 J2.3 J3.3 59.67,17.08 v59.69,17.07 | C4.1 13.21,27.48 C3.+ 8.64,27.99 J4.2
  Bottom 0.61: VCC1.T v59.69,17.07 | VCC2.T v59.69,36.12 | J4.2 10.41,27.61 | 10.41,27.61 10.79,27.61 | 10.79,27.23 10.79,17.96 11.67,17.08 v14.61,17.08 | 10.79,27.61 10.79,27.99 | 10.79,27.99 10.79,35.23 11.7,36.13 v14.61,36.13 | 10.41,27.61 10.79,27.99 | 10.41,27.61 10.79,27.23 | 10.79,27.23 10.79,27.61

### Text on the board
tPlace: 2 | 1 | www.seeedstudio.com | v1.0 11/28/2013 | SCL | RX | A2 | SDA | TX | A3 | VCC | VCC | VCC | GND | GND | GND | I2C2/CAN0 | 3V3 | UART2 | VCC | 5V | SCL | RX | A0 | SDA | TX | A1 | VCC | VCC | VCC | GND | GND | GND | I2C1 | UART1 | Grove Cape for BeagleBone Series | 20 | 40 | 2 | 1